# EAGLE schematic Controller (EAGLE 7.5.0)
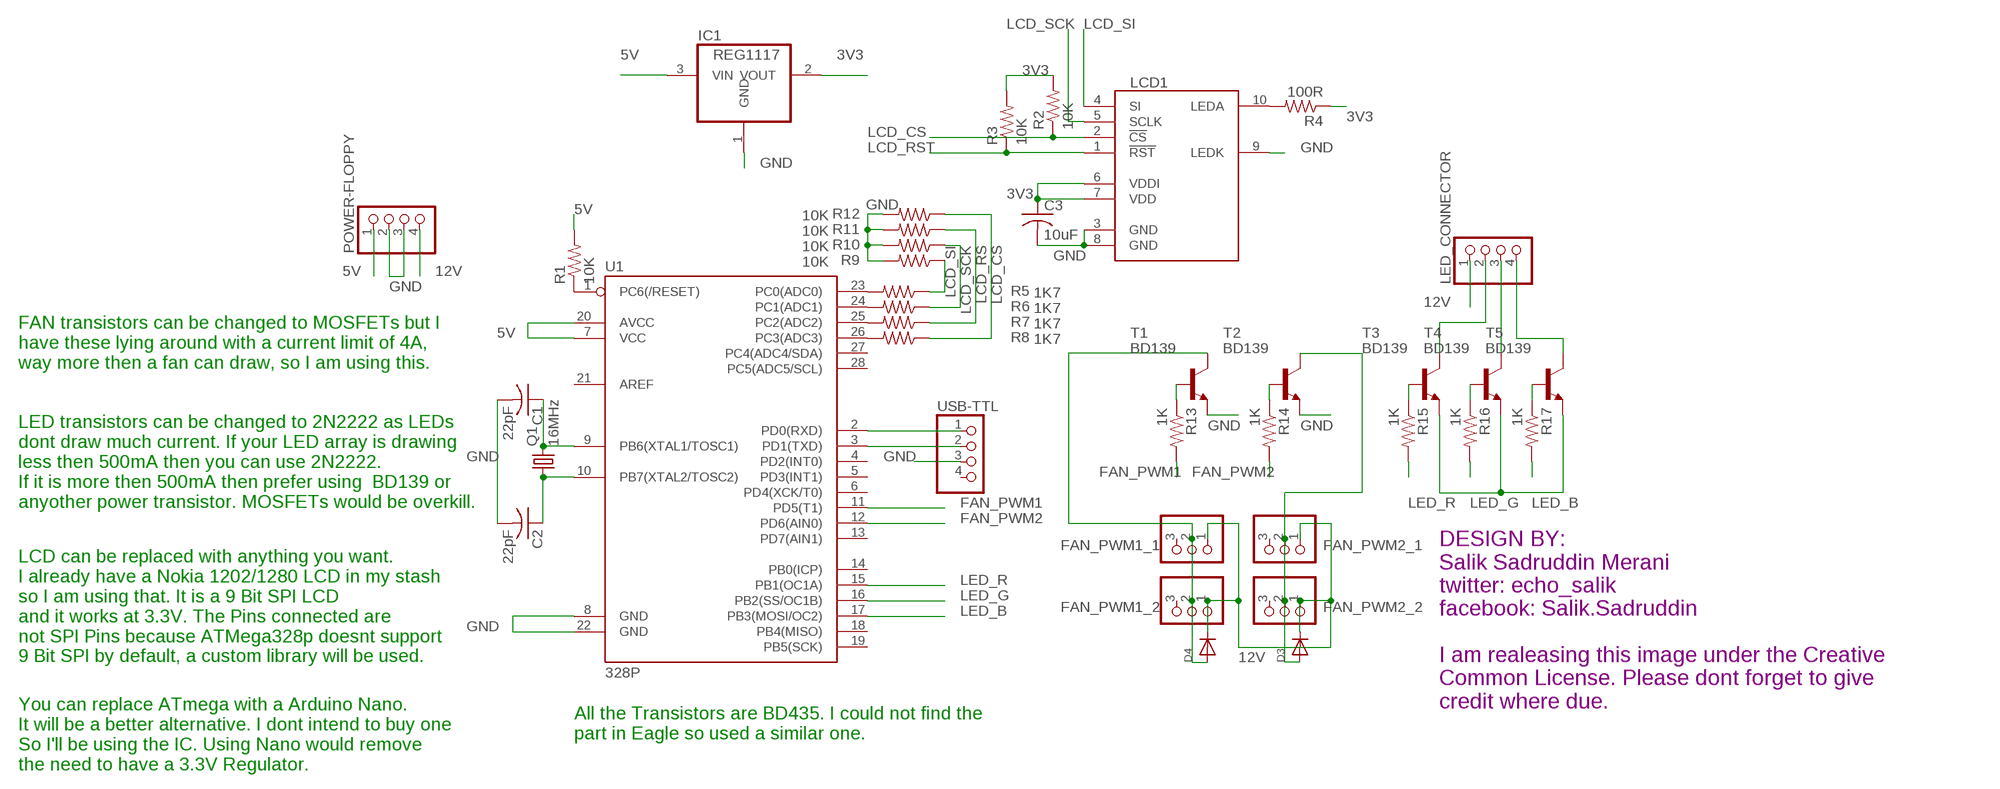
[diagram p0: schematic, sheet 1]

## Parts
C1  22pF  C-US050-025X075  [C050-025X075]
C2  22pF  C-US050-025X075  [C050-025X075]
C3  10uF  C-US050-025X075  [C050-025X075]
D3  DIODEDO-1N4148  [DO-1N4148]
D4  DIODEDO-1N4148  [DO-1N4148]
FAN_PWM1_1  PINHD-1X3  [1X03]
FAN_PWM1_2  PINHD-1X3  [1X03]
FAN_PWM2_1  PINHD-1X3  [1X03]
FAN_PWM2_2  PINHD-1X3  [1X03]
IC1  REG1117  [SOT223]
LCD1  LCD1202  [NOKIA1202LCD]
LED_CONNECTOR  PINHD-1X4  [1X04]
POWER-FLOPPY  PINHD-1X4  [1X04]
Q1  16MHz  CRYSTALHC49S  [HC49/S]
R1  10K  R-US_0207/10  [0207/10]
R2  10K  R-US_0207/10  [0207/10]
R3  10K  R-US_0207/10  [0207/10]
R4  100R  R-US_0207/10  [0207/10]
R5  1K7  R-US_0207/10  [0207/10]
R6  1K7  R-US_0207/10  [0207/10]
R7  1K7  R-US_0207/10  [0207/10]
R8  1K7  R-US_0207/10  [0207/10]
R9  10K  R-US_0207/10  [0207/10]
R10  10K  R-US_0207/10  [0207/10]
R11  10K  R-US_0207/10  [0207/10]
R12  10K  R-US_0207/10  [0207/10]
R13  1K  R-US_0207/10  [0207/10]
R14  1K  R-US_0207/10  [0207/10]
R15  1K  R-US_0207/10  [0207/10]
R16  1K  R-US_0207/10  [0207/10]
R17  1K  R-US_0207/10  [0207/10]
T1  BD139  [TO126]
T2  BD139  [TO126]
T3  BD139  [TO126]
T4  BD139  [TO126]
T5  BD139  [TO126]
U1  328P  ATMEGA328P_PDIP  [DIP28]
USB-TTL  PINHD-1X4  [1X04]

## Nets
3V3: C3.1 IC1.2(VOUT) LCD1.6(VDDI) LCD1.7(VDD) R2.2 R3.2 R4.1
5V: IC1.3(VIN) POWER-FLOPPY.1 R1.2 U1.7(VCC) U1.20(AVCC)
12V: D3.C D4.C FAN_PWM1_1.1 FAN_PWM1_2.1 FAN_PWM2_1.1 FAN_PWM2_2.1 LED_CONNECTOR.1 POWER-FLOPPY.4
FAN_PWM1: R13.2 U1.11(PD5(T1))
FAN_PWM2: R14.2 U1.12(PD6(AIN0))
GND: C1.2 C2.2 C3.2 IC1.1(GND) LCD1.3(GND) LCD1.8(GND) LCD1.9(LEDK) POWER-FLOPPY.2 POWER-FLOPPY.3 R9.2 R10.2 R11.2 R12.2 T1.1(E) T2.1(E) U1.8(GND) U1.22(GND) USB-TTL.3
LCD_CS: LCD1.2(!CS) R2.1 R8.1 R12.1
LCD_RS: R7.1 R11.1
LCD_RST: LCD1.1(!RST) R3.1
LCD_SCK: LCD1.5(SCLK) R6.1 R10.1
LCD_SI: LCD1.4(SI) R5.1 R9.1
LED_B: R17.2 U1.17(PB3(MOSI/OC2))
LED_G: R16.2 U1.16(PB2(SS/OC1B))
LED_R: R15.2 U1.15(PB1(OC1A))
N$1: C1.1 Q1.2 U1.9(PB6(XTAL1/TOSC1))
N$2: C2.1 Q1.1 U1.10(PB7(XTAL2/TOSC2))
N$3: R1.1 U1.1(PC6(/RESET))
N$4: LCD1.10(LEDA) R4.2
N$5: R5.2 U1.23(PC0(ADC0))
N$6: R6.2 U1.24(PC1(ADC1))
N$7: R7.2 U1.25(PC2(ADC2))
N$8: R8.2 U1.26(PC3(ADC3))
N$9: R13.1 T1.3(B)
N$10: R14.1 T2.3(B)
N$11: R15.1 T3.3(B)
N$12: R16.1 T4.3(B)
N$13: U1.2(PD0(RXD)) USB-TTL.1
N$14: U1.3(PD1(TXD)) USB-TTL.2
N$15: R17.1 T5.3(B)
N$18: T3.1(E) T4.1(E) T5.1(E)
N$19: D4.A FAN_PWM1_1.2 FAN_PWM1_2.2 T1.2(C)
N$22: LED_CONNECTOR.2 T3.2(C)
N$23: LED_CONNECTOR.3 T4.2(C)
N$24: LED_CONNECTOR.4 T5.2(C)
N$26: D3.A FAN_PWM2_1.2 FAN_PWM2_2.2 T2.2(C)
Unconnected: FAN_PWM1_1.3 FAN_PWM1_2.3 FAN_PWM2_1.3 FAN_PWM2_2.3 U1.4(PD2(INT0)) U1.5(PD3(INT1)) U1.6(PD4(XCK/T0)) U1.13(PD7(AIN1)) U1.14(PB0(ICP)) U1.18(PB4(MISO)) U1.19(PB5(SCK)) U1.21(AREF) U1.27(PC4(ADC4/SDA)) U1.28(PC5(ADC5/SCL)) USB-TTL.4

## Notes on the sheet
- FAN transistors can be changed to MOSFETs but I
  have these lying around with a current limit of 4A,
  way more then a fan can draw, so I am using this.
- LED transistors can be changed to 2N2222 as LEDs
  dont draw much current. If your LED array is drawing
  less then 500mA then you can use 2N2222.
  If it is more then 500mA then prefer using  BD139 or
  anyother power transistor. MOSFETs would be overkill.
- LCD can be replaced with anything you want.
  I already have a Nokia 1202/1280 LCD in my stash
  so I am using that. It is a 9 Bit SPI LCD 
  and it works at 3.3V. The Pins connected are 
  not SPI Pins because ATMega328p doesnt support 
  9 Bit SPI by default, a custom library will be used.
- DESIGN BY:
  Salik Sadruddin Merani
  twitter: echo_salik
  facebook: Salik.Sadruddin
  
  I am realeasing this image under the Creative
  Common License. Please dont forget to give 
  credit where due.
- All the Transistors are BD435. I could not find the
  part in Eagle so used a similar one.
- You can replace ATmega with a Arduino Nano.
  It will be a better alternative. I dont intend to buy one
  So I'll be using the IC. Using Nano would remove 
  the need to have a 3.3V Regulator.

## Library data of the parts
C1-C3 = adafruit:C-US: CAPACITOR, American symbol
D3 D4 = adafruit:DIODE: Diode SMADIODE - SMA Surface Mount Package 20V 1A Schottky Diode Digikey: 641-1014-6-ND DO-1N4148 - Through Hole Small Current Diode SOD-123 20V 1 A (.5mV Vf) Schottky Diode - Digikey: MBRX120TPMSCT-ND SOD-323 10V 570mA (.38mV Vf, 3ns) Schottky Diode - Digikey: ZLLS410CT-ND SOD-523 30V 30mA Schottky Diode (RB751S-40TE61) - Digikey: RB751S-40TE61CT-ND SOT23-R/W - SOT23 Package (R = Solder Paste/Reflow Ovens, W = Hand-Soldering) BAT54Film 40V 300mA - Digikey: 497-7162-1-ND
FAN_PWM1_1 FAN_PWM1_2 FAN_PWM2_1 FAN_PWM2_2 = pinhead:PINHD-1X3: PIN HEADER
IC1 = burr-brown:REG1117: 800mA and 1A Low Dropout (LDO) Positive Regulator 1.8V, 2.5V, 2.85V, 3.3V, 5V, and Adj; MPN: REG1117; OC_FARNELL: 1097566; OC_NEWARK: 14P6981
LCD1 = lcd1202:LCD1202: 1.3" b/w graphics display 96x68 pixel. From Nokia 1202 cell phone
LED_CONNECTOR POWER-FLOPPY USB-TTL = pinhead:PINHD-1X4: PIN HEADER
Q1 = crystal:CRYSTAL: CRYSTAL; OC_FARNELL: 1667008; OC_NEWARK: unknown
R1-R17 = adafruit:R-US_: RESISTOR, American symbol
T1-T5 = transistor:BD139: NPN TRANSISTOR
U1 = SparkFun-IC-Microcontroller:ATMEGA328P_PDIP: Atmel 328P Through hole ATMEGA328P uC used in the Arduino 32kb flash, 1k EEPROM, 2k SRAM Datasheet <http://www.sparkfun.com/datasheets/Components/SMD/ATMega328.pdf> SparkFun Products Storefront component: AVR 28 Pin 20MHz 32K 6A/D - ATMega328P <https://www.sparkfun.com/products/9061> (COM-09061) SparkFun Simon Says - Through-Hole Soldering Kit <https://www.sparkfun.com/products/10547> (KIT-10547) SparkFun Learn to Solder - Simon Says <https://www.sparkfun.com/products/13708> (KIT-13708) SparkFun BigTime Watch Kit <https://www.sparkfun.com/products/11734> (KIT-11734) SparkFun ClockIt <https://www.sparkfun.com/products/10930> (KIT-10930) SparkFun Serial Enabled LCD Kit <https://www.sparkfun.com/products/10097> (LCD-10097) SparkFun Simon Tilts - Through Hole Soldering Kit <https://www.sparkfun.com/products/12634> (KIT-12634) SparkFun Frequency Counter Kit <https://www.sparkfun.com/products/10140> (KIT-10140) FabFM Radio Kit <https://www.sparkfun.com/products/11043> (KIT-11043) SparkFun Binary Blaster Kit <https://www.sparkfun.com/products/12037> (KIT-12037) SparkFun Metro-Gnome <https://www.sparkfun.com/products/9236> (KIT-09236) ATmega328 with Arduino Optiboot (Uno) <https://www.sparkfun.com/products/10524> (DEV-10524); PROD_ID: IC-09136